# EAGLE schematic arduino_midi2cv_gate_unbuffered (EAGLE 6.5.0)
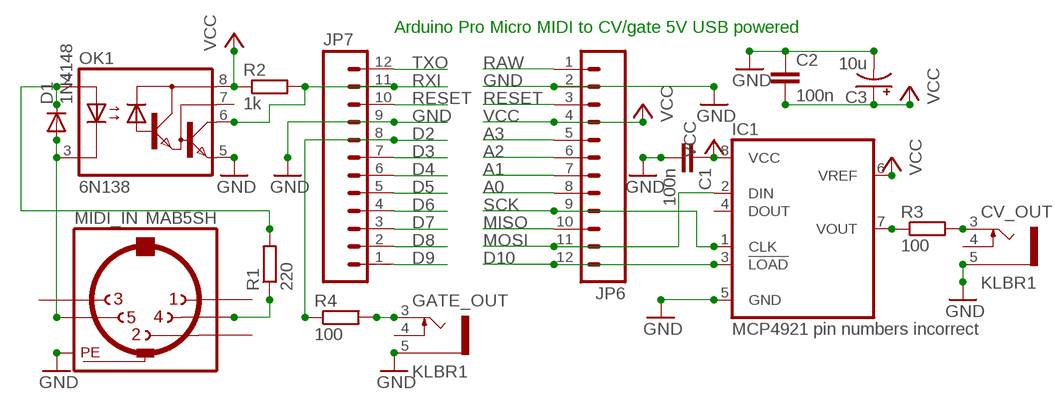
[diagram p0: schematic, sheet 1]

## Parts
C1  100n  C2,5-3  [C2.5-3]
C2  100n  C2,5-3  [C2.5-3]
C3  10u  CPOL-US085CS-1AR  [085CS_1AR]
CV_OUT  KLBR1  [KLBR1]
D1  1N4148  1N4148DO35-10  [DO35-10]
GATE_OUT  KLBR1  [KLBR1]
IC1  MCP4921 pin numbers incorrect  LT1257N  [DIL08]
JP6  M12PTH  [1X12]
JP7  M12PTH  [1X12]
MIDI_IN  MAB5SH  [MAB5SH]
OK1  6N138  [DIL08]
R1  220  R-EU_0204/5  [0204/5]
R2  1k  R-EU_0204/5  [0204/5]
R3  100  R-EU_0204/2V  [0204V]
R4  100  R-EU_0204/2V  [0204V]

## Nets
A0: JP6.8
A1: JP6.7
A2: JP6.6
A3: JP6.5
D2: JP7.8 R4.1
D3: JP7.7
D4: JP7.6
D5: JP7.5
D6: JP7.4
D7: JP7.3
D8: JP7.2
D9: JP7.1
D10: IC1.3(!LOAD) JP6.12
GND [vcc]: C1.2 C2.1 C3.- CV_OUT.5 GATE_OUT.5 IC1.5(GND) JP6.2 JP7.9 MIDI_IN.PE MIDI_IN.PE@(PE) OK1.5(GND)
MISO: JP6.10
MOSI: IC1.2(DIN) JP6.11
N$1: IC1.7(VOUT) R3.1
N$2: D1.A MIDI_IN.5 OK1.3(C)
N$3: MIDI_IN.4 R1.1
N$4: CV_OUT.3 R3.2
N$5: C1.1 IC1.8(VCC)
N$6: D1.C OK1.2(A) R1.2
N$7: IC1.6(VREF)
N$10: GATE_OUT.3 R4.2
RAW [vcc]: JP6.1
RESET: JP6.3 JP7.10
RXI: JP7.11 OK1.6(VO) R2.2
SCK: IC1.1(CLK) JP6.9
TXO: JP7.12
VCC: C2.2 C3.+ JP6.4 OK1.8(VCC) R2.1
Unconnected: CV_OUT.4 GATE_OUT.4 IC1.4(DOUT) MIDI_IN.1 MIDI_IN.2 MIDI_IN.3 OK1.7(VB)

## Notes on the sheet
- Arduino Pro Micro MIDI to CV/gate 5V USB powered

## Library data of the parts
C1 C2 = capacitor-wima:C: CAPACITOR naming: grid - package width
C3 = adafruit:CPOL-US: POLARIZED CAPACITOR, American symbol
CV_OUT GATE_OUT = con-lumberg:KLBR?: Jack connectors according to JISC 6560, 2.5mm / 3.5 mm Klinkensteckverbinder nach JISC 6560, 2.5mm / 3,5 mm Source: http://www.lumberg.com/Produkte/PDFs/KLBR2.pdf www.lumberg.com/Produkte/PDFs/KLBR1.pdf; MPN: KLBR 1; OC_FARNELL: 1200140; OC_NEWARK: 97K2707
D1 = diode:1N4148: DIODE high speed (Philips)
IC1 = linear-technology:LT1257: Complete Single Supply 12-Bit Voltage Output DAC Source: http://www.linear.com/pc/downloadDocument.do?navId=H0,C1,C1155,C1005,C1156,P1425,D3414; OC_FARNELL: unknown; OC_NEWARK: unknown
JP6 JP7 = SparkFun:M12: Header 12 Standard 12-pin 0.1" header. Use with straight break away headers (SKU : PRT-00116), right angle break away headers (PRT-00553), swiss pins (PRT-00743), machine pins (PRT-00117), and female headers (PRT-00115).
MIDI_IN = con-hirschmann:MAB5SH: Female CONNECTOR 5 pins 90 deg. with shield, horizontal (DIN 41524); OC_FARNELL: 809883; OC_NEWARK: unknown
OK1 = optocoupler:6N138: MOTOROLA OPTO COUPLER; MF: VISHAY/TELEFUNKEN; MPN: 6N138; OC_FARNELL: 9860150; OC_NEWARK: 35K5294
R1-R4 = rcl:R-EU_: RESISTOR, European symbol

## Net classes
0 default: width 0.203 mm
1 vcc: width 0.254 mm